# EAGLE design G203B (EAGLE 6.6.0)
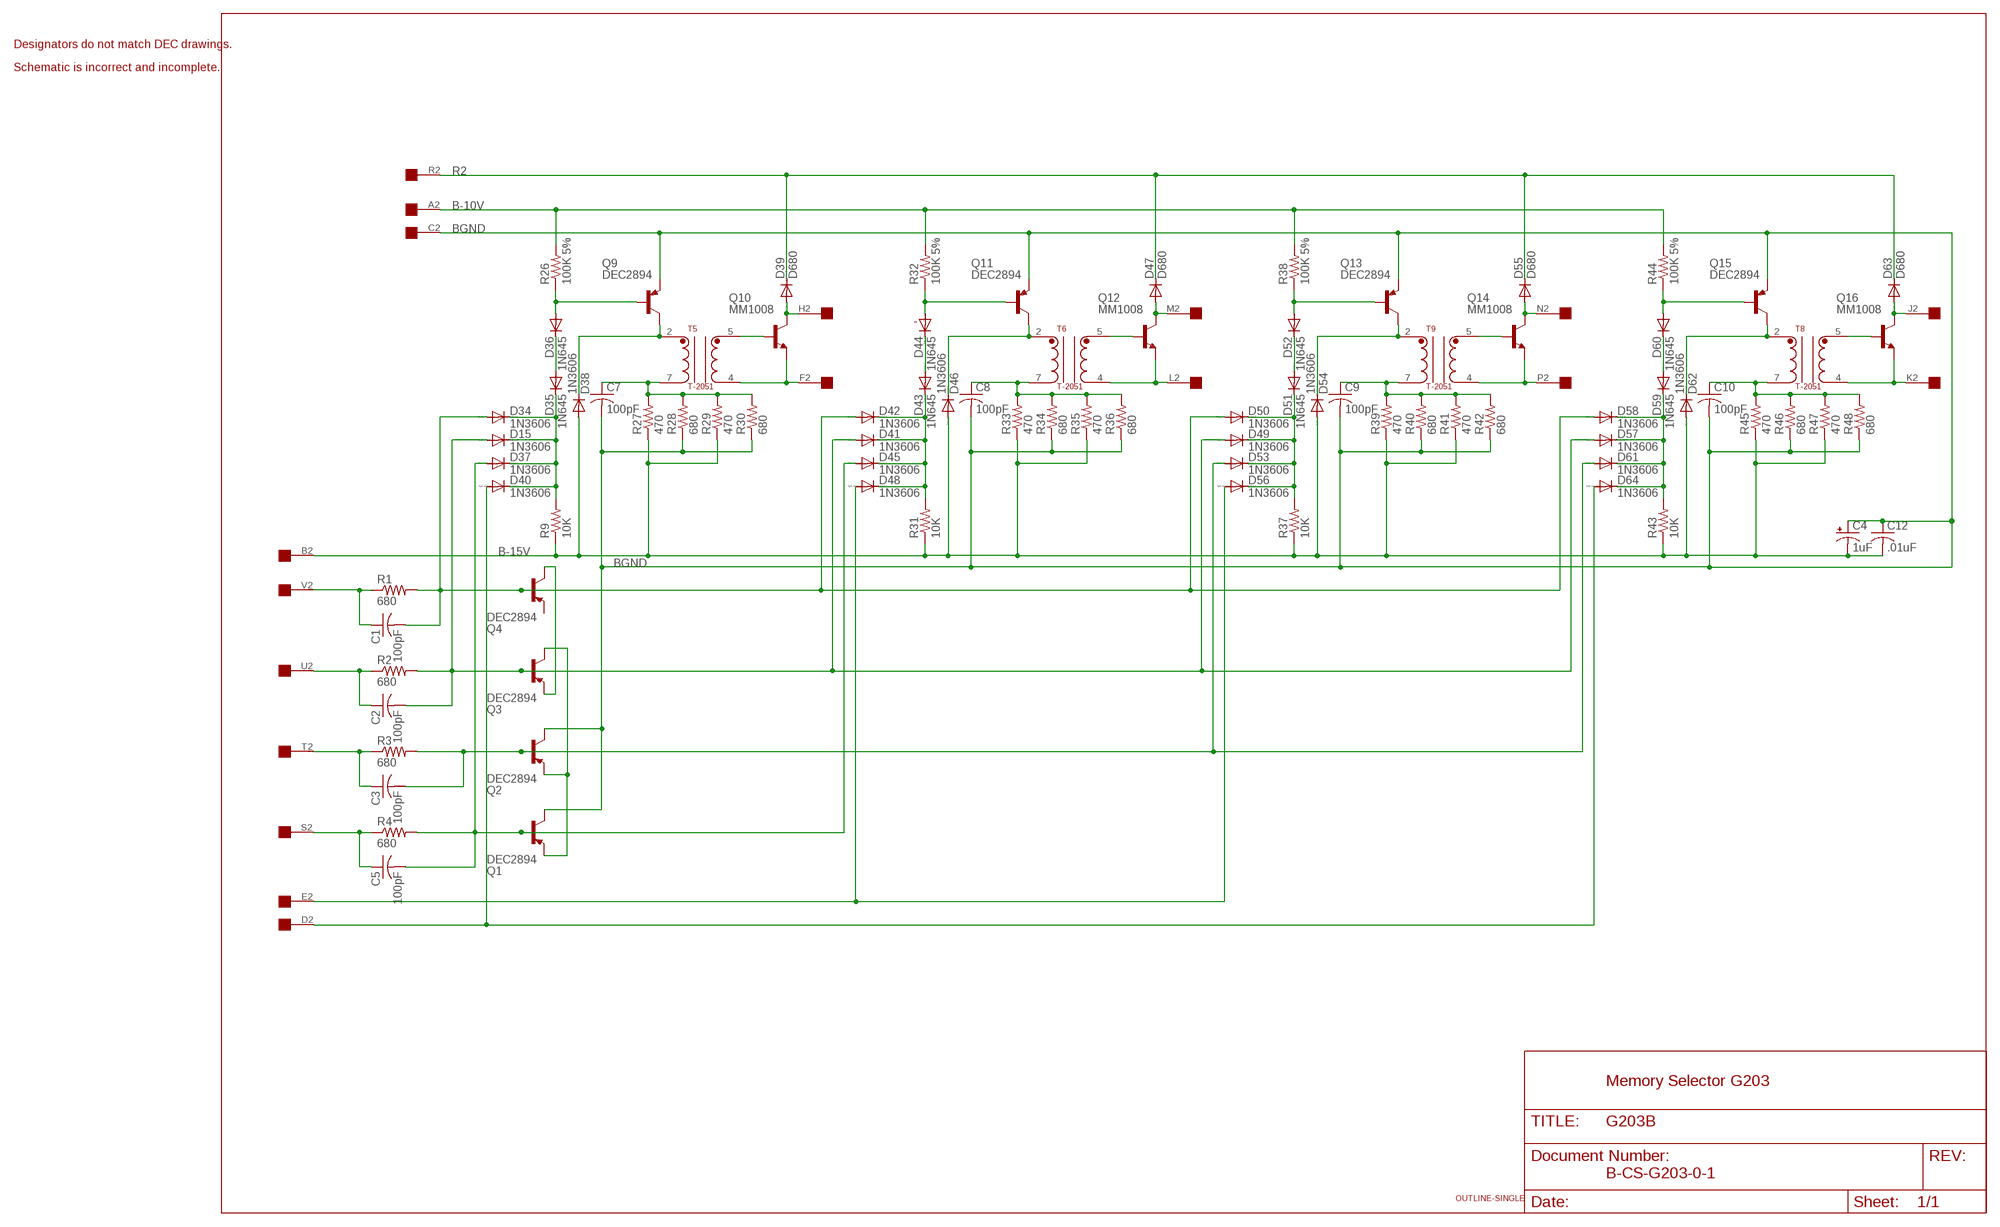
[diagram p0: schematic, sheet 1]

## Parts
C1  100pF  C-US075-032X103  [C075-032X103]
C2  100pF  C-US075-032X103  [C075-032X103]
C3  100pF  C-US075-032X103  [C075-032X103]
C4  1uF  CPOL-USE12-4AXIAL  [E12-4]
C5  100pF  C-US075-032X103  [C075-032X103]
C7  100pF  C-US075-032X103  [C075-032X103]
C8  100pF  C-US075-032X103  [C075-032X103]
C9  100pF  C-US075-032X103  [C075-032X103]
C10  100pF  C-US075-032X103  [C075-032X103]
C12  .01uF  C-US050-025X075  [C050-025X075]
D15  1N3606  1N4148DO35-10  [DO35-10]
D34  1N3606  1N4148DO35-10  [DO35-10]
D35  1N645  1N4148DO35-10  [DO35-10]
D36  1N645  1N4148DO35-10  [DO35-10]
D37  1N3606  1N4148DO35-10  [DO35-10]
D38  1N3606  1N4148DO35-10  [DO35-10]
D39  D680  1N4148DO35-10  [DO35-10]
D40  1N3606  1N4148DO35-10  [DO35-10]
D41  1N3606  1N4148DO35-10  [DO35-10]
D42  1N3606  1N4148DO35-10  [DO35-10]
D43  1N645  1N4148DO35-10  [DO35-10]
D44  1N645  1N4148DO35-10  [DO35-10]
D45  1N3606  1N4148DO35-10  [DO35-10]
D46  1N3606  1N4148DO35-10  [DO35-10]
D47  D680  1N4148DO35-10  [DO35-10]
D48  1N3606  1N4148DO35-10  [DO35-10]
D49  1N3606  1N4148DO35-10  [DO35-10]
D50  1N3606  1N4148DO35-10  [DO35-10]
D51  1N645  1N4148DO35-10  [DO35-10]
D52  1N645  1N4148DO35-10  [DO35-10]
D53  1N3606  1N4148DO35-10  [DO35-10]
D54  1N3606  1N4148DO35-10  [DO35-10]
D55  D680  1N4148DO35-10  [DO35-10]
D56  1N3606  1N4148DO35-10  [DO35-10]
D57  1N3606  1N4148DO35-10  [DO35-10]
D58  1N3606  1N4148DO35-10  [DO35-10]
D59  1N645  1N4148DO35-10  [DO35-10]
D60  1N645  1N4148DO35-10  [DO35-10]
D61  1N3606  1N4148DO35-10  [DO35-10]
D62  1N3606  1N4148DO35-10  [DO35-10]
D63  D680  1N4148DO35-10  [DO35-10]
D64  1N3606  1N4148DO35-10  [DO35-10]
Q1  DEC2894  2N2904  [TO39]
Q2  DEC2894  2N2904  [TO39]
Q3  DEC2894  2N2904  [TO39]
Q4  DEC2894  2N2904  [TO39]
Q9  DEC2894  2N2904  [TO39]
Q10  MM1008  2N2102  [TO5]
Q11  DEC2894  2N2904  [TO39]
Q12  MM1008  2N2102  [TO5]
Q13  DEC2894  2N2904  [TO39]
Q14  MM1008  2N2102  [TO5]
Q15  DEC2894  2N2904  [TO39]
Q16  MM1008  2N2102  [TO5]
R1  680  R-US_0207/10  [0207/10]
R2  680  R-US_0207/10  [0207/10]
R3  680  R-US_0207/10  [0207/10]
R4  680  R-US_0207/10  [0207/10]
R9  10K  R-US_0207/10  [0207/10]
R26  100K 5%  R-US_0207/10  [0207/10]
R27  470  R-US_0207/10  [0207/10]
R28  680  R-US_0207/10  [0207/10]
R29  470  R-US_0207/10  [0207/10]
R30  680  R-US_0207/10  [0207/10]
R31  10K  R-US_0207/10  [0207/10]
R32  100K 5%  R-US_0207/10  [0207/10]
R33  470  R-US_0207/10  [0207/10]
R34  680  R-US_0207/10  [0207/10]
R35  470  R-US_0207/10  [0207/10]
R36  680  R-US_0207/10  [0207/10]
R37  10K  R-US_0207/10  [0207/10]
R38  100K 5%  R-US_0207/10  [0207/10]
R39  470  R-US_0207/10  [0207/10]
R40  680  R-US_0207/10  [0207/10]
R41  470  R-US_0207/10  [0207/10]
R42  680  R-US_0207/10  [0207/10]
R43  10K  R-US_0207/10  [0207/10]
R44  100K 5%  R-US_0207/10  [0207/10]
R45  470  R-US_0207/10  [0207/10]
R46  680  R-US_0207/10  [0207/10]
R47  470  R-US_0207/10  [0207/10]
R48  680  R-US_0207/10  [0207/10]
T5  T-2051  [TRANSFORMER]
T6  T-2051  [TRANSFORMER]
T8  T-2051  [TRANSFORMER]
T9  T-2051  [TRANSFORMER]
U$1  OUTLINE-SINGLE  [SINGLE]
U$2  EDGE-1  [EDGE-CON1]

## Nets
B-10V [Supply]: R26.2 R32.2 R38.2 R44.2 U$2.A2
B-15V [Supply]: C4.- C12.2 D38.A D46.A D54.A D62.A R9.1 R27.1 R29.1 R31.1 R33.1 R35.1 R37.1 R39.1 R41.1 R43.1 R45.1 R47.1 U$2.B2
BGND [Supply]: C4.+ C7.2 C8.2 C9.2 C10.2 C12.1 Q1.3(C) Q2.3(C) Q9.1(E) Q11.1(E) Q13.1(E) Q15.1(E) R28.1 R30.1 R34.1 R36.1 R40.1 R42.1 R46.1 R48.1 U$2.C2
D2: D40.A D64.A U$2.D2
E2: D48.A D56.A U$2.E2
F2: Q10.1(E) T5.4 U$2.F2
H2: D39.A Q10.3(C) U$2.H2
J2: D63.A Q16.3(C) U$2.J2
K2: Q16.1(E) T8.4 U$2.K2
L2: Q12.1(E) T6.4 U$2.L2
M2: D47.A Q12.3(C) U$2.M2
N2: D55.A Q14.3(C) U$2.N2
N$1: C8.1 R33.2 R34.2 R35.2 R36.2 T6.7
N$2: C9.1 R39.2 R40.2 R41.2 R42.2 T9.7
N$3: C1.2 D34.A D42.A D50.A D58.A Q4.2(B) R1.2
N$4: Q3.1(E) Q4.3(C)
N$5: Q1.1(E) Q2.1(E) Q3.3(C)
N$6: C2.2 D15.A D41.A D49.A D57.A Q3.2(B) R2.2
N$8: C3.2 D53.A D61.A Q2.2(B) R3.2
N$9: C5.2 D37.A D45.A Q1.2(B) R4.2
N$21: D15.C D34.C D35.C D37.C D40.C R9.2
N$22: D35.A D36.C
N$30: D36.A Q9.2(B) R26.1
N$31: D38.C Q9.3(C) T5.2
N$32: C7.1 R27.2 R28.2 R29.2 R30.2 T5.7
N$33: Q10.2(B) T5.5
N$54: D41.C D42.C D43.C D45.C D48.C R31.2
N$55: D43.A D44.C
N$56: D44.A Q11.2(B) R32.1
N$57: D46.C Q11.3(C) T6.2
N$59: Q12.2(B) T6.5
N$62: D49.C D50.C D51.C D53.C D56.C R37.2
N$63: D51.A D52.C
N$64: D52.A Q13.2(B) R38.1
N$65: D54.C Q13.3(C) T9.2
N$67: Q14.2(B) T9.5
N$69: D57.C D58.C D59.C D61.C D64.C R43.2
N$70: D59.A D60.C
N$71: D60.A Q15.2(B) R44.1
N$72: D62.C Q15.3(C) T8.2
N$73: C10.1 R45.2 R46.2 R47.2 R48.2 T8.7
N$74: Q16.2(B) T8.5
P2: Q14.1(E) T9.4 U$2.P2
R2: D39.C D47.C D55.C D63.C U$2.R2
S2: C5.1 R4.1 U$2.S2
T2: C3.1 R3.1 U$2.T2
U2: C2.1 R2.1 U$2.U2
V2: C1.1 R1.1 U$2.V2
Unconnected: Q4.1(E)

## Notes on the sheet
- Designators do not match DEC drawings.
- Schematic is incorrect and incomplete.
- -
- Memory Selector G203
- B-CS-G203-0-1

## Library data of the parts
C1-C3 C5 C7-C10 C12 = rcl:C-US: CAPACITOR, American symbol
C4 = dec-con:CPOL-USE12-4AXIAL: 0.5" version of an electrolytic
D15 D34-D64 = diode:1N4148: DIODE high speed (Philips)
Q1-Q4 Q9 Q11 Q13 Q15 = transistor-pnp:2N2904*: PNP Transistror
Q10 Q12 Q14 Q16 = transistor:2N2102: NPN TRANSISTOR
R1-R4 R9 R26-R48 = rcl:R-US_: RESISTOR, American symbol
T5 T6 T8 T9 = dec-con:T-2051: T-2052 Transformer
U$1 = dec-con:OUTLINE-*: Board outlines for DEC boards.
U$2 = dec-con:EDGE-1: Single-Sided DEC Edge Connector -- (side 2)

## Net classes
1 Supply: width 0.813 mm

## Board
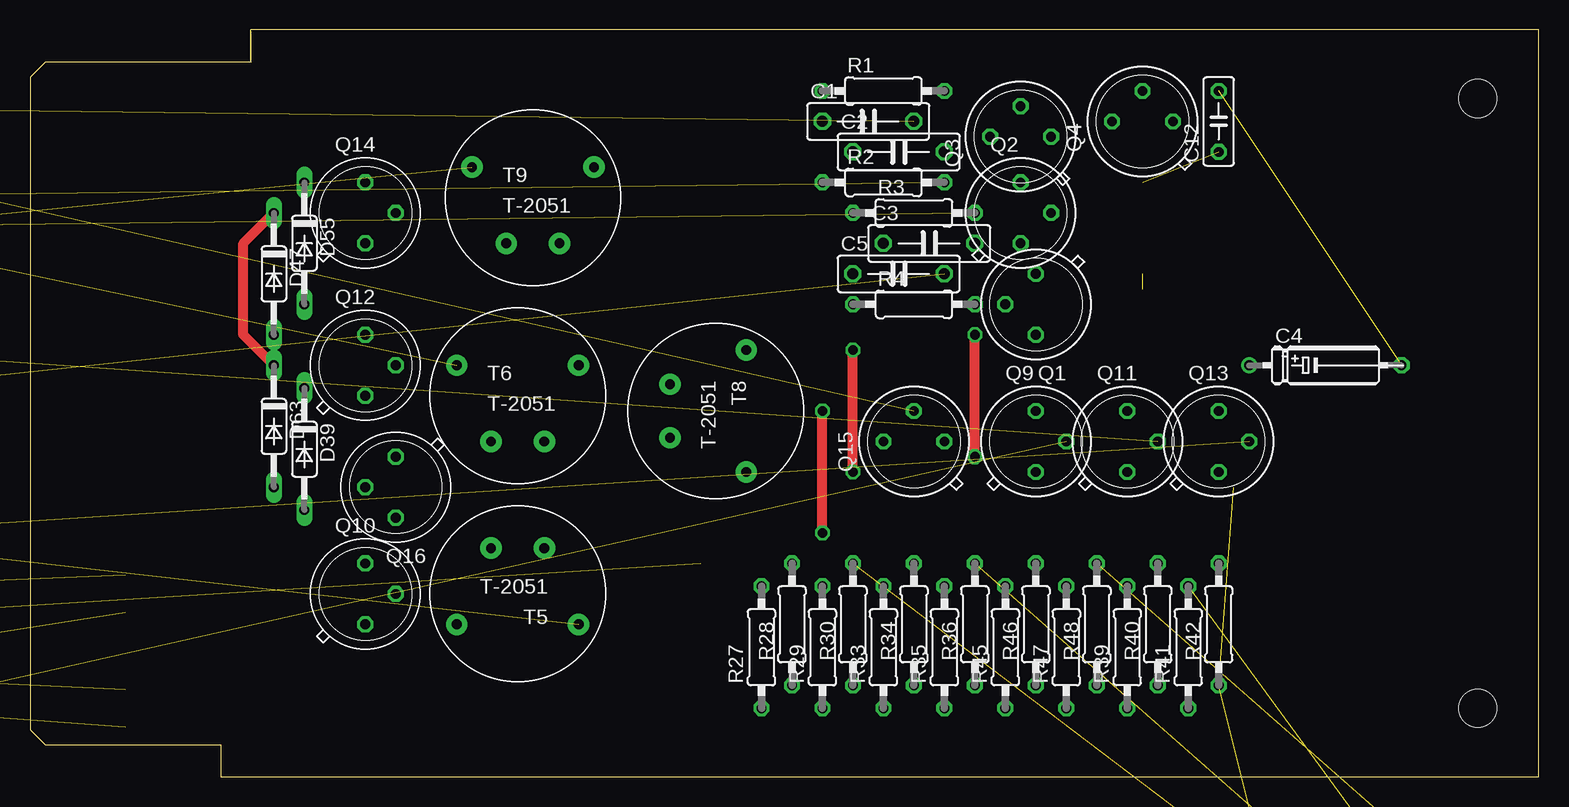
[diagram p1: board, top side]
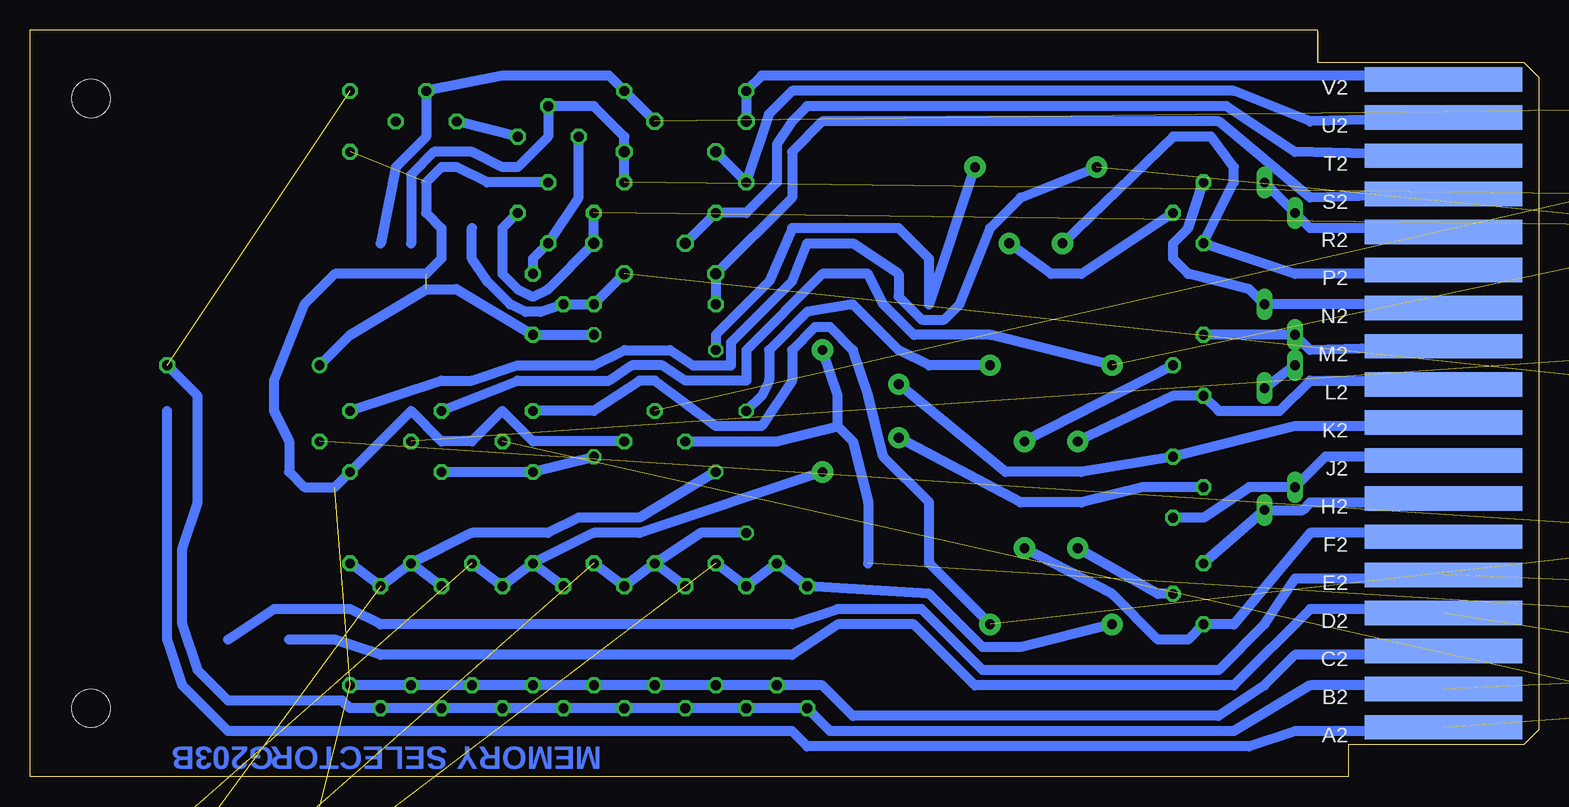
[diagram p2: board, bottom side, seen from below]

Size 125.73 x 62.23 mm. Coordinates in mm from the lower left corner, seen from the top.
Copper layers (1+16): Top 0.035mm / dielectric 1.5mm / Bottom 0.035mm
Design rules "16mils": minimum track width 16mil, minimum drill 32mil, track to track 15mil, track to pad 10mil, pad to pad 10mil, via to via 10mil, smd to smd 10mil, copper to edge 13mil, drill to drill 10mil, minimum pad ring 10mil, minimum via ring 8mil, stop-mask expansion 0mil, vias tented up to drill 0mil, thermal gap 10mil

### Footprints (pad centres in the part's own frame; a part is rotated, then mirrored left to right if it is on the bottom)
C075-032X103 = drill 0.914 octagon: 1 -3.81,0; 2 3.81,0
E12-4 = drill 0.813: + -7.62,0 | drill 0.813 octagon: - 5.08,0
C050-025X075 = drill 0.813 octagon: 1 -2.54,0; 2 2.54,0
DO35-10 = drill 0.813 long: A 5.08,0; C -5.08,0
TO39 = drill 0.813 octagon: 1 0,-2.54; 2 2.54,0; 3 0,2.54
TO5 = drill 0.813 octagon: 1 0,-2.54; 2 2.54,0; 3 0,2.54
0207/10 = drill 0.813 octagon: 1 -5.08,0; 2 5.08,0
TRANSFORMER = drill 0.813 pad 1.778: 2 -5.08,2.54; 4 -2.223,-3.81; 5 2.223,-3.81; 7 5.08,2.54
SINGLE = hole 3.175: 120.65,56.515; 120.65,5.715
EDGE-CON1 = smd 13.106 x 2.032 bottom: A2 7.938,4.128; B2 7.938,7.303; C2 7.938,10.477; D2 7.938,13.652; E2 7.938,16.828; F2 7.938,20.003; H2 7.938,23.177; J2 7.938,26.352; K2 7.938,29.527; L2 7.938,32.703; M2 7.938,35.877; N2 7.938,39.053; P2 7.938,42.227; R2 7.938,45.403; S2 7.938,48.578; T2 7.938,51.752; U2 7.938,54.928; V2 7.938,58.102

### Placement (x,y rotation side)
C1  69.85,54.61 0 top
C2  72.39,52.07 0 top
C3  74.93,44.45 0 top
C4  109.22,34.29 0 top
C5  72.39,41.91 0 top
C7  105.41,-13.97 270 top  (outside the outline)
C8  110.49,-13.97 270 top  (outside the outline)
C9  115.57,-13.97 270 top  (outside the outline)
C10  120.65,-13.97 270 top  (outside the outline)
C12  99.06,54.61 90 top
D15  -35.56,0 0 top  (outside the outline)
D34  -35.56,10.16 0 top  (outside the outline)
D35  -35.56,5.08 0 top  (outside the outline)
D36  -22.86,5.08 0 top  (outside the outline)
D37  -35.56,2.54 0 top  (outside the outline)
D38  -60.96,25.4 0 top  (outside the outline)
D39  22.86,27.3 270 top
D40  -35.56,7.62 0 top  (outside the outline)
D41  -35.56,40.64 0 top  (outside the outline)
D42  -35.56,38.1 0 top  (outside the outline)
D43  -35.56,35.56 0 top  (outside the outline)
D44  -22.86,35.56 0 top  (outside the outline)
D45  -35.56,30.48 0 top  (outside the outline)
D46  -60.96,55.88 0 top  (outside the outline)
D47  20.32,41.91 270 top
D48  -35.56,33.02 0 top  (outside the outline)
D49  -35.56,25.4 0 top  (outside the outline)
D50  -35.56,22.86 0 top  (outside the outline)
D51  -35.56,20.32 0 top  (outside the outline)
D52  -22.86,20.32 0 top  (outside the outline)
D53  -35.56,17.78 0 top  (outside the outline)
D54  -60.96,40.64 0 top  (outside the outline)
D55  22.86,44.45 270 top
D56  -35.56,15.24 0 top  (outside the outline)
D57  -35.56,48.26 0 top  (outside the outline)
D58  -35.56,55.88 0 top  (outside the outline)
D59  -35.56,50.8 0 top  (outside the outline)
D60  -22.86,50.8 0 top  (outside the outline)
D61  -35.56,45.72 0 top  (outside the outline)
D62  -60.96,10.16 0 top  (outside the outline)
D63  20.32,29.21 270 top
D64  -35.56,53.34 0 top  (outside the outline)
Q1  83.82,39.37 180 top
Q2  82.55,46.99 0 top
Q3  82.55,53.34 90 top
Q4  92.71,54.61 90 top
Q9  83.82,27.94 0 top
Q10  27.94,15.24 0 top
Q11  91.44,27.94 0 top
Q12  27.94,34.29 0 top
Q13  99.06,27.94 0 top
Q14  27.94,46.99 0 top
Q15  73.66,27.94 90 top
Q16  30.48,24.13 180 top
R1  71.12,57.15 0 top
R2  71.12,49.53 0 top
R3  73.66,46.99 0 top
R4  73.66,39.37 0 top
R9  -48.26,10.16 0 top  (outside the outline)
R26  -10.16,5.08 0 top  (outside the outline)
R27  60.96,10.79 90 top
R28  63.5,12.7 90 top
R29  66.04,10.79 90 top
R30  68.58,12.7 90 top
R31  -48.26,40.64 0 top  (outside the outline)
R32  -10.16,35.56 0 top  (outside the outline)
R33  71.12,10.79 90 top
R34  73.66,12.7 90 top
R35  76.2,10.79 90 top
R36  78.74,12.7 90 top
R37  -48.26,25.4 0 top  (outside the outline)
R38  -10.16,20.32 0 top  (outside the outline)
R39  91.44,10.79 90 top
R40  93.98,12.7 90 top
R41  96.52,10.79 90 top
R42  99.06,12.7 90 top
R43  -48.26,55.88 0 top  (outside the outline)
R44  -10.16,50.8 0 top  (outside the outline)
R45  81.28,10.79 90 top
R46  83.82,12.7 90 top
R47  86.36,10.79 90 top
R48  88.9,12.7 90 top
T5  40.64,15.24 180 top
T6  40.64,31.75 0 top
T8  57.15,30.48 270 top
T9  41.91,48.26 0 top
U$1  0,0 0 top
U$2  0,0 0 top

### Tracks (layer width: path | path; a pad name or v marks a point on that pad's centre or on a via)
B-10V  (4 unrouted)
  Bottom 0.813: U$2.A2 13.97,3.81 20.32,3.81 24.13,2.54 60.96,2.54 62.23,3.81 109.22,3.81 113.03,7.62 114.3,11.43 114.3,30.48
B-15V  (9 unrouted)
  Bottom 0.813: U$2.B2 13.34,7.62 19.05,7.62 25.4,3.81 59.06,3.81 R27.1 R29.1 R33.1 R35.1 R45.1 R47.1 R39.1 R41.1 99.06,5.71 99.7,6.35 109.22,6.35 111.76,8.89 113.03,12.7 113.03,19.05 111.76,22.86 111.76,31.75 C4.-
BGND  (via drill 0.81)  (7 unrouted)
  Top 0.813: v78.74,26.67 v78.74,36.83
  Bottom 0.813: U$2.C2 13.97,10.16 20.32,10.16 22.86,7.62 26.67,5.08 57.15,5.08 59.69,7.62 R28.1 R30.1 R34.1 R36.1 R46.1 R48.1 R40.1 R42.1 | Q11.1 Q9.1 v78.74,26.67 | Q15.1 83.82,27.94 86.36,30.48 88.9,27.94 91.44,27.94 93.98,30.48 Q13.1 100.33,24.13 102.87,24.13 104.14,25.4 104.14,27.94 105.41,30.48 105.41,33.02 102.87,39.37 100.33,41.91 92.71,41.91 91.44,43.18 91.44,45.72 92.71,46.99 92.71,49.53 91.44,50.8 90.17,50.8 87.63,49.53 Q2.3 | C4.+ 99.06,36.83 92.71,40.64 90.17,40.64 Q1.3 v78.74,36.83
D2  (2 unrouted)
  Bottom 0.813: U$2.D2 13.97,13.97 19.05,13.97 25.4,7.62 46.99,7.62 52.07,12.7 58.42,12.7 62.23,10.16 96.52,10.16 100.33,11.43 104.14,11.43
E2  (2 unrouted)
  Bottom 0.813: U$2.E2 13.97,16.51 20.32,16.51 22.86,12.7 26.67,8.89 46.36,8.89 51.44,13.97 58.42,13.97 62.23,12.7 96.52,12.7 99.06,13.97 105.41,13.97 109.22,11.43
F2
  Bottom 0.813: U$2.F2 12.7,20.32 19.05,20.32 25.4,12.7 Q10.1 29.21,11.43 31.75,11.43 35.56,15.24 T5.4
H2
  Bottom 0.813: Q10.3 D39.A 19.69,22.23 19.05,22.86 13.97,22.86 U$2.H2
J2
  Bottom 0.813: U$2.J2 13.97,26.67 17.78,26.67 D63.A 24.13,24.13 27.94,21.59 Q16.3
K2
  Bottom 0.813: U$2.K2 13.97,29.21 20.32,29.21 Q16.1 38.1,25.4 44.45,25.4 T8.4
L2
  Bottom 0.813: U$2.L2 13.97,33.02 19.05,33.02 21.59,30.48 26.67,30.48 Q12.1 30.48,31.75 T6.4
M2
  Bottom 0.813: U$2.M2 19.05,35.56 D47.A Q12.3
N2
  Bottom 0.813: U$2.N2 13.34,39.37 D55.A 24.13,40.64 29.21,41.91 30.48,43.18 30.48,44.45 29.21,45.72 Q14.3
N$1  (via drill 0.81)  (1 unrouted)
  Top 0.813: v66.04,20.32 v66.04,30.48
  Bottom 0.813: T6.7 50.8,34.29 53.34,35.56 57.15,39.37 60.96,38.73 64.14,35.56 64.14,33.02 64.77,31.75 v66.04,30.48 | R33.2 R34.2 | R34.2 R35.2 R36.2 | v66.04,20.32 69.85,20.32 R34.2
N$2  (via drill 0.81)  (1 unrouted)
  Top 0.813: v68.58,25.4 v68.58,35.56
  Bottom 0.813: T9.7 50.8,39.37 50.8,43.18 53.34,45.72 62.23,45.72 64.14,41.27 68.58,36.83 v68.58,35.56 | R39.2 R40.2 | R40.2 R41.2 R42.2 | v68.58,25.4 74.93,21.59 80.01,21.59 82.55,20.32 88.9,20.32 R40.2
N$3  (4 unrouted)
  Bottom 0.813: C1.2 R1.2 77.47,58.42 86.36,58.42 Q4.2 92.71,53.34 95.25,50.8 96.52,44.45
N$4
  Bottom 0.813: Q3.1 Q4.3
N$5
  Bottom 0.813: Q3.3 80.01,48.26 Q2.1 83.82,43.18 Q1.1
N$6  (4 unrouted)
  Bottom 0.813: R2.2 C2.2 76.2,53.34 78.74,55.88 Q3.2 82.55,53.34 85.09,50.8 86.36,50.8 88.9,52.07 92.08,52.07 93.98,50.16 93.98,44.45
N$8  (2 unrouted)
  Bottom 0.813: R3.2 C3.2 82.55,40.64 83.82,40.01 85.09,40.64 86.36,41.91 86.36,45.72 Q2.2
N$9  (2 unrouted)
  Bottom 0.813: C5.2 R4.2 Q1.2 83.19,38.73 84.46,38.73 85.73,39.37 87.63,41.27 88.9,43.18 88.9,45.72
N$21  (5 unrouted)
N$22  (1 unrouted)
N$30  (2 unrouted)
N$31  (1 unrouted)
  Bottom 0.813: T5.2 50.8,17.78 50.8,22.86 54.61,26.67 55.88,31.75 57.15,35.56 59.06,37.47 60.33,37.47 62.23,35.56 62.23,33.02 64.77,29.21 68.58,29.21 73.66,33.02 74.93,33.02 78.74,30.48 Q9.3
N$32  (1 unrouted)
  Bottom 0.813: T5.7 43.18,10.79 46.36,10.79 50.8,15.24 R27.2 R28.2 R29.2 R30.2
N$33
  Bottom 0.813: Q10.2 31.75,15.24 T5.5
N$54  (5 unrouted)
N$55  (1 unrouted)
N$56  (2 unrouted)
N$57  (1 unrouted)
  Bottom 0.813: Q11.3 85.09,33.02 77.47,33.02 75.57,34.29 73.03,34.29 71.12,33.02 66.04,33.02 66.04,35.56 59.69,41.91 55.88,41.91 54.61,39.37 52.07,36.83 45.72,36.83 T6.2
N$59
  Bottom 0.813: Q12.2 T6.5
N$62  (5 unrouted)
N$63  (1 unrouted)
N$64  (2 unrouted)
N$65  (1 unrouted)
  Bottom 0.813: Q13.3 91.44,33.02 88.9,33.02 85.09,34.29 78.74,34.29 76.2,35.56 72.39,35.56 70.49,34.29 67.31,34.29 67.31,36.2 62.23,41.27 60.96,44.45 57.15,44.45 53.34,41.91 53.34,40.01 51.44,38.1 49.53,38.1 48.26,39.37 45.72,45.72 43.18,48.26 T9.2
N$67
  Bottom 0.813: Q14.2 38.1,41.91 40.64,41.91 T9.5
N$69  (5 unrouted)
N$70  (1 unrouted)
N$71  (2 unrouted)
N$72  (1 unrouted)
  Bottom 0.813: Q15.3 63.5,27.94 58.42,29.21 | 58.42,29.21 58.42,31.75 T8.2 | 58.42,29.21 57.15,27.94 55.88,22.86 55.88,17.78
N$73  (1 unrouted)
  Bottom 0.813: R45.2 R46.2 | R46.2 R47.2 R48.2 | T8.7 74.93,20.32 78.74,20.32 R46.2
N$74
  Bottom 0.813: Q16.2 33.02,24.13 38.1,22.86 43.18,22.86 T8.5
P2
  Bottom 0.813: U$2.P2 13.97,41.91 20.32,41.91 Q14.1 25.4,49.53 25.4,50.8 27.31,53.34 30.48,53.34 T9.4
R2
  Top 0.813: D63.C 17.78,36.83 17.78,44.45 D47.C
  Bottom 0.813: U$2.R2 8.89,45.72 19.05,45.72 D47.C D55.C | D39.C D63.C
S2
  Bottom 0.813: U$2.S2 19.05,48.26 26.67,54.61 59.69,54.61 62.23,52.07 62.23,48.26 C5.1 R4.1
T2
  Bottom 0.813: U$2.T2 20.32,52.07 26.04,55.88 60.96,55.88 62.23,54.61 63.5,52.7 63.5,49.53 66.04,46.99 R3.1 C3.1
U2
  Bottom 0.813: U$2.U2 19.05,54.61 25.4,57.15 62.23,57.15 64.14,55.24 R2.1 C2.1
V2
  Bottom 0.813: U$2.V2 8.89,58.42 64.77,58.42 R1.1 C1.1

### Text on the board
Bottom: MEMORY SELECTOR | G203B